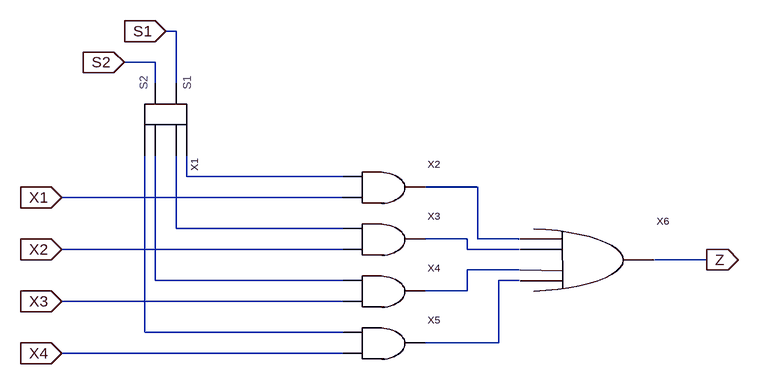
[diagram p0: schematic multiplexer_4_in_1.asc]
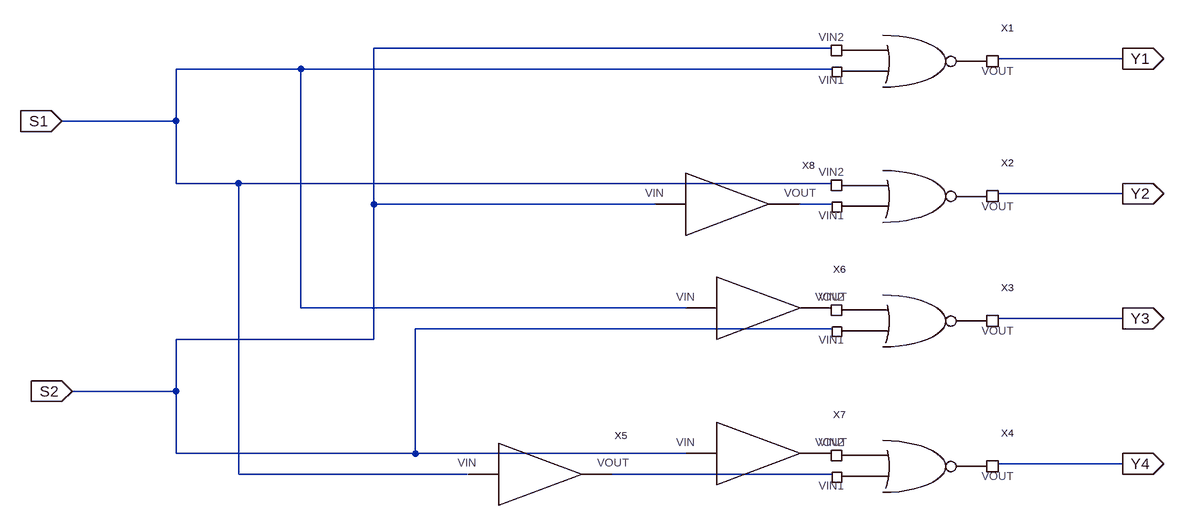
[diagram p1: sub-circuit decoder.asc]
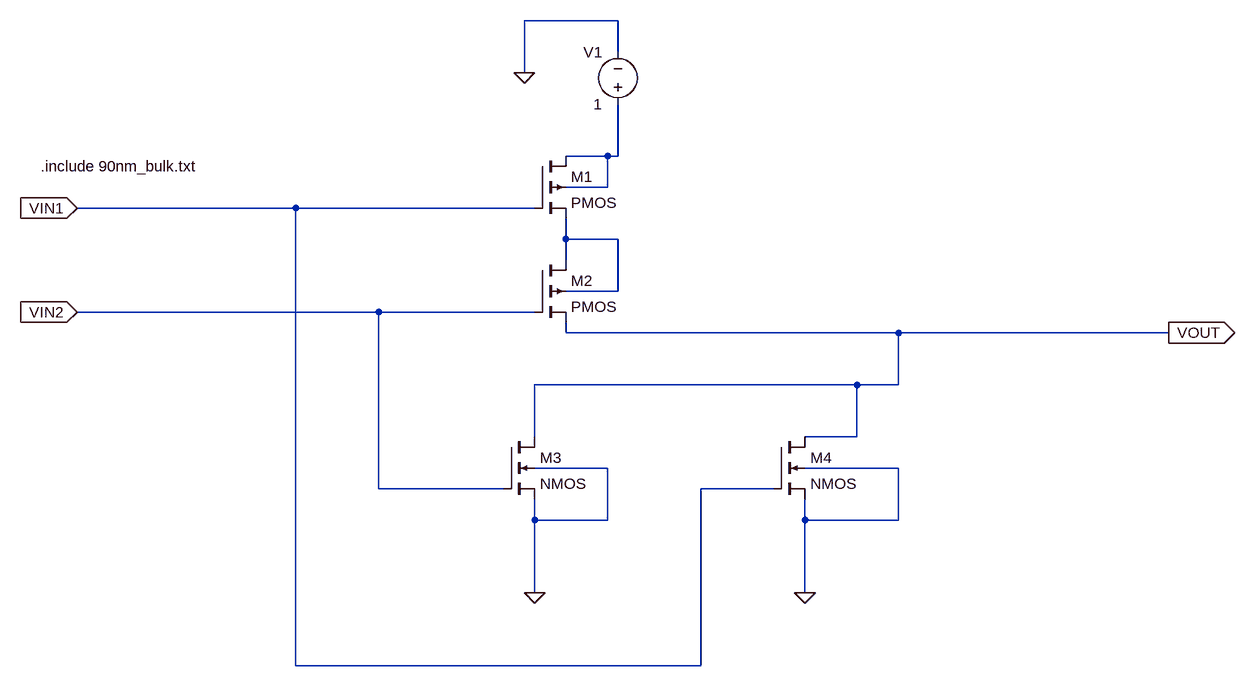
[diagram p2: sub-circuit symbol_valve.asc]
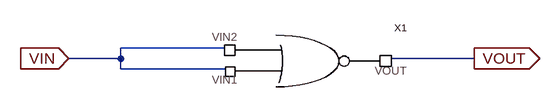
[diagram p3: sub-circuit not.asc]
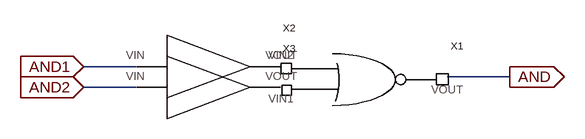
[diagram p4: sub-circuit and2.asc]
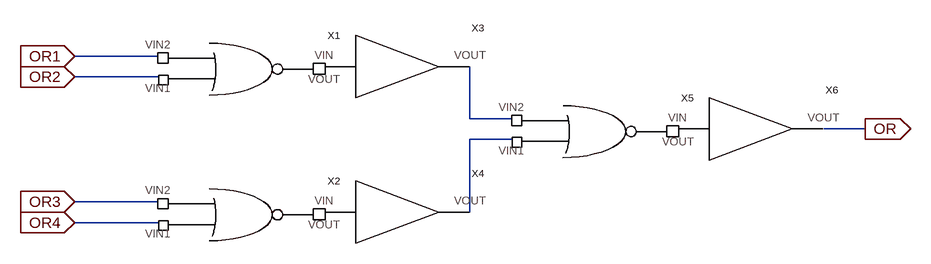
[diagram p5: sub-circuit or4.asc]
multiplexer_4_in_1.asc, the LTspice schematic file:
Version 4
SHEET 1 1096 680
WIRE 208 -48 192 -48
WIRE 176 0 128 0
WIRE 176 32 176 0
WIRE 208 32 208 -48
WIRE 224 176 224 144
WIRE 464 176 224 176
WIRE 672 192 592 192
WIRE 464 208 32 208
WIRE 208 256 208 144
WIRE 464 256 208 256
WIRE 656 272 592 272
WIRE 672 272 672 192
WIRE 736 272 672 272
WIRE 464 288 32 288
WIRE 656 288 656 272
WIRE 736 288 656 288
WIRE 1024 304 944 304
WIRE 736 320 656 320
WIRE 176 336 176 144
WIRE 464 336 176 336
WIRE 736 336 704 336
WIRE 656 352 656 320
WIRE 656 352 592 352
WIRE 464 368 32 368
WIRE 160 416 160 144
WIRE 464 416 160 416
WIRE 704 432 704 336
WIRE 704 432 592 432
WIRE 464 448 32 448
FLAG 192 -48 S1
IOPIN 192 -48 In
FLAG 128 0 S2
IOPIN 128 0 In
FLAG 32 208 X1
IOPIN 32 208 In
FLAG 32 288 X2
IOPIN 32 288 In
FLAG 32 368 X3
IOPIN 32 368 In
FLAG 32 448 X4
IOPIN 32 448 In
FLAG 1024 304 Z
IOPIN 1024 304 Out
SYMBOL decoder 192 96 R90
SYMATTR InstName X1
SYMBOL and2 496 208 R0
SYMATTR InstName X2
SYMBOL and2 496 288 R0
SYMATTR InstName X3
SYMBOL and2 496 368 R0
SYMATTR InstName X4
SYMBOL and2 496 448 R0
SYMATTR InstName X5
SYMBOL or4 656 336 R0
SYMATTR InstName X6

decoder.asc, the sub-circuit schematic file:
Version 4
SHEET 1 2184 680
WIRE 1648 -448 944 -448
WIRE 2096 -432 1904 -432
WIRE 832 -416 640 -416
WIRE 1648 -416 832 -416
WIRE 640 -336 640 -416
WIRE 640 -336 464 -336
WIRE 640 -240 640 -336
WIRE 736 -240 640 -240
WIRE 1648 -240 736 -240
WIRE 2096 -224 1904 -224
WIRE 944 -208 944 -448
WIRE 1376 -208 944 -208
WIRE 1648 -208 1600 -208
WIRE 832 -48 832 -416
WIRE 1424 -48 832 -48
WIRE 2096 -32 1904 -32
WIRE 1648 -16 1008 -16
WIRE 944 0 944 -208
WIRE 944 0 640 0
WIRE 640 80 640 0
WIRE 640 80 480 80
WIRE 640 176 640 80
WIRE 1008 176 1008 -16
WIRE 1008 176 640 176
WIRE 1424 176 1008 176
WIRE 2096 192 1904 192
WIRE 736 208 736 -240
WIRE 1088 208 736 208
WIRE 1648 208 1312 208
FLAG 464 -336 S1
IOPIN 464 -336 In
FLAG 480 80 S2
IOPIN 480 80 In
FLAG 2096 -432 Y1
IOPIN 2096 -432 Out
FLAG 2096 -224 Y2
IOPIN 2096 -224 Out
FLAG 2096 -32 Y3
IOPIN 2096 -32 Out
FLAG 2096 192 Y4
IOPIN 2096 192 Out
SYMBOL symbol_valve 1776 -368 R0
SYMATTR InstName X1
SYMBOL symbol_valve 1776 -160 R0
SYMATTR InstName X2
SYMBOL symbol_valve 1776 32 R0
SYMATTR InstName X3
SYMBOL symbol_valve 1776 256 R0
SYMATTR InstName X4
SYMBOL not 1168 208 R0
SYMATTR InstName X5
SYMBOL not 1504 -48 R0
SYMATTR InstName X6
SYMBOL not 1504 176 R0
SYMATTR InstName X7
SYMBOL not 1456 -208 R0
WINDOW 39 0 0 Left 0
SYMATTR InstName X8

symbol_valve.asc, the sub-circuit schematic file:
Version 4
SHEET 1 1116 900
WIRE 144 -96 0 -96
WIRE 144 -48 144 -96
WIRE 0 -16 0 -96
WIRE 128 112 64 112
WIRE 144 112 144 32
WIRE 144 112 128 112
WIRE 128 160 128 112
WIRE 128 160 64 160
WIRE -352 192 -688 192
WIRE 16 192 -352 192
WIRE 64 240 64 208
WIRE 144 240 64 240
WIRE 64 272 64 240
WIRE 144 320 144 240
WIRE 144 320 64 320
WIRE -224 352 -688 352
WIRE 16 352 -224 352
WIRE 64 384 64 368
WIRE 576 384 64 384
WIRE 992 384 576 384
WIRE 512 464 16 464
WIRE 576 464 576 384
WIRE 576 464 512 464
WIRE 16 544 16 464
WIRE 512 544 512 464
WIRE 512 544 432 544
WIRE 128 592 16 592
WIRE 576 592 432 592
WIRE -224 624 -224 352
WIRE -32 624 -224 624
WIRE 384 624 272 624
WIRE 16 672 16 640
WIRE 128 672 128 592
WIRE 128 672 16 672
WIRE 432 672 432 640
WIRE 576 672 576 592
WIRE 576 672 432 672
WIRE 16 784 16 672
WIRE 432 784 432 672
WIRE -352 896 -352 192
WIRE 272 896 272 624
WIRE 272 896 -352 896
FLAG 16 784 0
FLAG 432 784 0
FLAG 992 384 VOUT
IOPIN 992 384 Out
FLAG -688 192 VIN1
IOPIN -688 192 In
FLAG -688 352 VIN2
IOPIN -688 352 In
FLAG 0 -16 0
SYMBOL pmos4 16 112 R0
SYMATTR InstName M1
SYMATTR Value2 l=90n w=400n
SYMBOL pmos4 16 272 R0
SYMATTR InstName M2
SYMATTR Value2 l=90n w=400n
SYMBOL nmos4 -32 544 R0
SYMATTR InstName M3
SYMATTR Value2 l=90n w=200n
SYMBOL nmos4 384 544 R0
SYMATTR InstName M4
SYMATTR Value2 l=90n w=200n
SYMBOL voltage 144 48 R180
WINDOW 0 24 96 Left 2
WINDOW 3 24 16 Left 2
WINDOW 123 0 0 Left 0
WINDOW 39 0 0 Left 0
SYMATTR InstName V1
SYMATTR Value 1
TEXT -744 128 Left 2 !.include 90nm_bulk.txt

not.asc, the sub-circuit schematic file:
Version 4
SHEET 1 880 680
WIRE 128 160 -32 160
WIRE -32 176 -32 160
WIRE -32 176 -112 176
WIRE 512 176 384 176
WIRE -32 192 -32 176
WIRE 128 192 -32 192
FLAG -112 176 VIN
IOPIN -112 176 In
FLAG 512 176 VOUT
IOPIN 512 176 Out
SYMBOL symbol_valve 256 240 R0
SYMATTR InstName X1

and2.asc, the sub-circuit schematic file:
Version 4
SHEET 1 880 680
WIRE -96 144 -176 144
WIRE 480 160 384 160
WIRE -96 176 -176 176
FLAG -176 144 AND1
IOPIN -176 144 In
FLAG -176 176 AND2
IOPIN -176 176 In
FLAG 480 160 AND
IOPIN 480 160 Out
SYMBOL symbol_valve 256 224 R0
SYMATTR InstName X1
SYMBOL not -16 144 R0
SYMATTR InstName X2
SYMBOL not -16 176 R0
SYMATTR InstName X3

or4.asc, the sub-circuit schematic file:
Version 4
SHEET 1 1324 680
WIRE 144 128 16 128
WIRE 144 160 16 160
WIRE 624 224 624 144
WIRE 688 224 624 224
WIRE 1232 240 1168 240
WIRE 688 256 624 256
WIRE 144 352 16 352
WIRE 624 368 624 256
WIRE 144 384 16 384
FLAG 16 128 OR1
IOPIN 16 128 In
FLAG 16 160 OR2
IOPIN 16 160 In
FLAG 16 352 OR3
IOPIN 16 352 In
FLAG 16 384 OR4
IOPIN 16 384 In
FLAG 1232 240 OR
IOPIN 1232 240 Out
SYMBOL symbol_valve 272 208 R0
SYMATTR InstName X1
SYMBOL symbol_valve 272 432 R0
SYMATTR InstName X2
SYMBOL not 480 144 R0
SYMATTR InstName X3
SYMBOL not 480 368 R0
SYMATTR InstName X4
SYMBOL symbol_valve 816 304 R0
SYMATTR InstName X5
SYMBOL not 1024 240 R0
SYMATTR InstName X6

The netlist it stands for:
* multiplexer_4_in_1.asc
XX1 S2 S1 N001 N003 N006 N008 decoder
XX2 N001 X1 N002 and2
XX3 N003 X2 N004 and2
XX4 N006 X3 N005 and2
XX5 N008 X4 N007 and2
XX6 N002 N004 N005 N007 Z or4

* block symbol definitions
.subckt decoder S2 S1 Y1 Y2 Y3 Y4
XX1 S1 S2 Y1 symbol_valve
XX2 N001 S1 Y2 symbol_valve
XX3 S2 P001 Y3 symbol_valve
XX4 N002 P002 Y4 symbol_valve
XX5 S1 N002 not
XX6 S1 P001 not
XX7 S2 P002 not
XX8 S2 N001 not
.ends decoder

.subckt symbol_valve VIN1 VIN2 VOUT
M1 N001 VIN1 N002 N001 PMOS l=90n w=400n
M2 N002 VIN2 VOUT N002 PMOS l=90n w=400n
M3 VOUT VIN2 0 0 NMOS l=90n w=200n
M4 VOUT VIN1 0 0 NMOS l=90n w=200n
V1 N001 0 1
.include 90nm_bulk.txt
.ends symbol_valve

.subckt not VIN VOUT
XX1 VIN VIN VOUT symbol_valve
.ends not

.subckt and2 AND1 AND2 AND
XX1 P001 P002 AND symbol_valve
XX2 AND1 P002 not
XX3 AND2 P001 not
.ends and2

.subckt or4 OR1 OR2 OR3 OR4 OR
XX1 OR2 OR1 P001 symbol_valve
XX2 OR4 OR3 P002 symbol_valve
XX3 P001 N001 not
XX4 P002 N002 not
XX5 N002 N001 P003 symbol_valve
XX6 P003 OR not
.ends or4

.model NMOS NMOS
.model PMOS PMOS
.lib standard.mos
.backanno
.end